# Altium schematic sheet micron_P8.SchDoc
size A; SheetNumber: 8; SheetTotal: 11
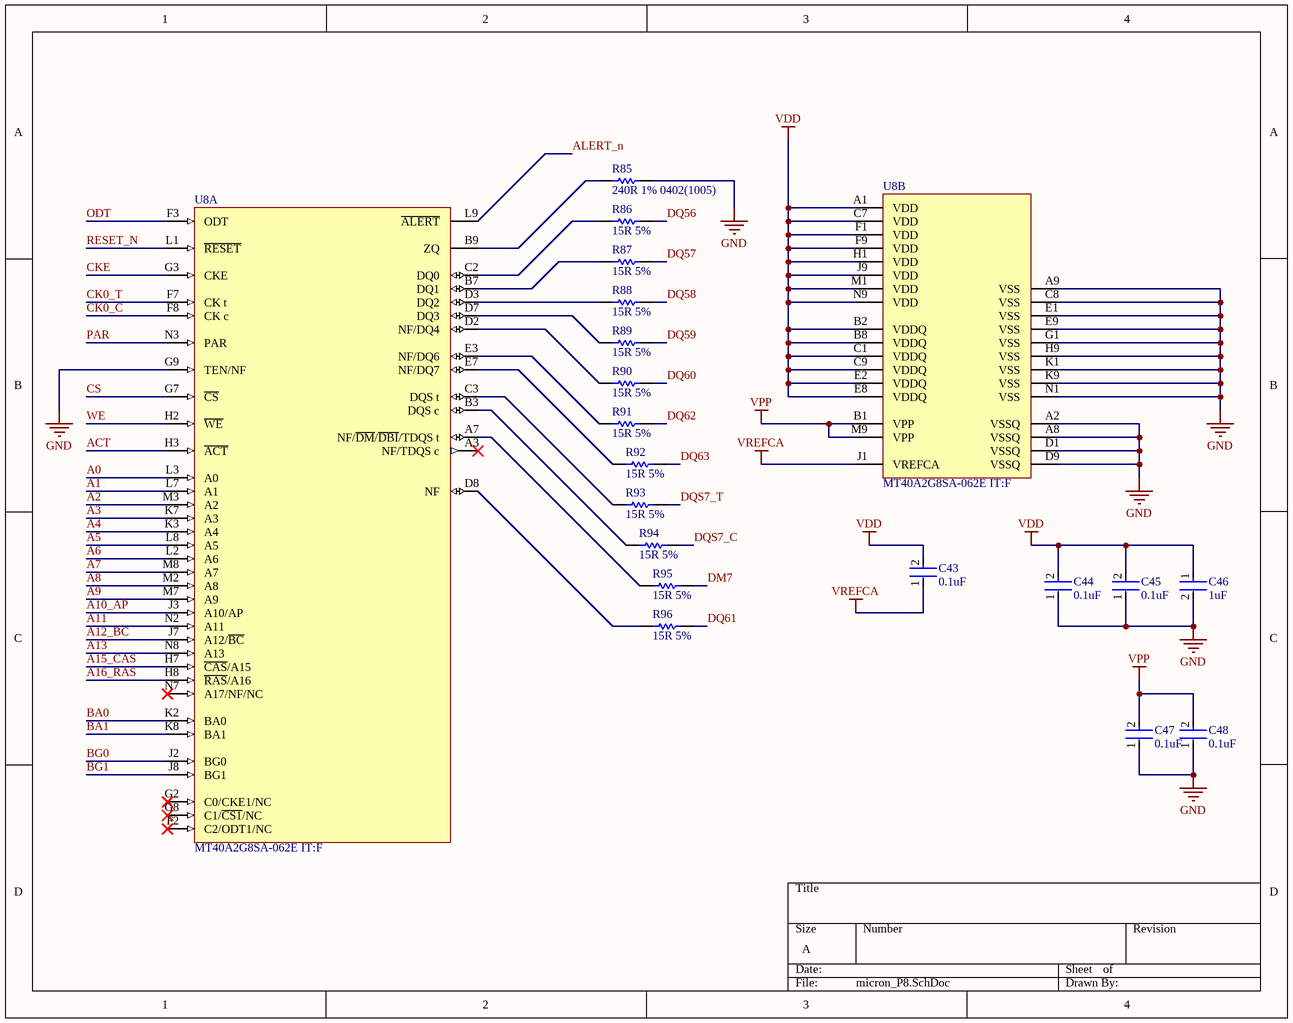
[diagram p0: micron_P8.SchDoc]

## Parts
C43  0.1uF  [FP-GRM15-MFG]
C44  0.1uF  [FP-GRM15-MFG]
C45  0.1uF  [FP-GRM15-MFG]
C46  1uF  [FP-CL511-IPC_C]
C47  0.1uF  [FP-GRM15-MFG]
C48  0.1uF  [FP-GRM15-MFG]
R85  240R 1% 0402(1005)  [RESC0402(1005)_L]
R86  15R 5%  [RESC1005X40X25LL05T10]
R87  15R 5%  [RESC1005X40X25LL05T10]
R88  15R 5%  [RESC1005X40X25LL05T10]
R89  15R 5%  [RESC1005X40X25LL05T10]
R90  15R 5%  [RESC1005X40X25LL05T10]
R91  15R 5%  [RESC1005X40X25LL05T10]
R92  15R 5%  [RESC1005X40X25LL05T10]
R93  15R 5%  [RESC1005X40X25LL05T10]
R94  15R 5%  [RESC1005X40X25LL05T10]
R95  15R 5%  [RESC1005X40X25LL05T10]
R96  15R 5%  [RESC1005X40X25LL05T10]
U8  MT40A2G8SA-062E IT:F  [SA_MFG]  (parts A,B of 2)

## Nets
GND: C44.1 C45.1 C46.2 C47.1 C48.1 R85.2 U8.A2(VSSQ) U8.A8(VSSQ) U8.A9(VSS) U8.C8(VSS) U8.D1(VSSQ) U8.D9(VSSQ) U8.E1(VSS) U8.E9(VSS) U8.G1(VSS) U8.G9(TEN/NF) U8.H9(VSS) U8.K1(VSS) U8.K9(VSS) U8.N1(VSS)
VDD: C43.2 C44.2 C45.2 C46.1 U8.A1(VDD) U8.B2(VDDQ) U8.B8(VDDQ) U8.C1(VDDQ) U8.C7(VDD) U8.C9(VDDQ) U8.E2(VDDQ) U8.E8(VDDQ) U8.F1(VDD) U8.F9(VDD) U8.H1(VDD) U8.J9(VDD) U8.M1(VDD) U8.N9(VDD)
VPP: C47.2 C48.2 U8.B1(VPP) U8.M9(VPP)
VREFCA: C43.1 U8.J1(VREFCA)
A0: U8.L3(A0)
A1: U8.L7(A1)
A2: U8.M3(A2)
A3: U8.K7(A3)
A4: U8.K3(A4)
A5: U8.L8(A5)
A6: U8.L2(A6)
A7: U8.M8(A7)
A8: U8.M2(A8)
A9: U8.M7(A9)
A10_AP: U8.J3(A10/AP)
A11: U8.N2(A11)
A12_BC: U8.J7(A12/~{BC})
A13: U8.N8(A13)
A15_CAS: U8.H7(~{CAS}/A15)
A16_RAS: U8.H8(~{RAS}/A16)
ACT: U8.H3(~{ACT})
ALERT_n: U8.L9(~{ALERT})
BA0: U8.K2(BA0)
BA1: U8.K8(BA1)
BG0: U8.J2(BG0)
BG1: U8.J8(BG1)
CK0_C: U8.F8(CK_c)
CK0_T: U8.F7(CK_t)
CKE: U8.G3(CKE)
CS: U8.G7(~{CS})
DM7: R95.2
DQ56: R86.2
DQ57: R87.2
DQ58: R88.2
DQ59: R89.2
DQ60: R90.2
DQ61: R96.2
DQ62: R91.2
DQ63: R92.2
DQS7_C: R94.2
DQS7_T: R93.2
ODT: U8.F3(ODT)
PAR: U8.N3(PAR)
RESET_N: U8.L1(~{RESET})
WE: U8.H2(~{WE})
NetR85_1: R85.1 U8.B9(ZQ)
NetR86_1: R86.1 U8.C2(DQ0)
NetR87_1: R87.1 U8.B7(DQ1)
NetR88_1: R88.1 U8.D3(DQ2)
NetR89_1: R89.1 U8.D7(DQ3)
NetR90_1: R90.1 U8.D2(NF/DQ4)
NetR91_1: R91.1 U8.E3(NF/DQ6)
NetR92_1: R92.1 U8.E7(NF/DQ7)
NetR93_1: R93.1 U8.C3(DQS_t)
NetR94_1: R94.1 U8.B3(DQS_c)
NetR95_1: R95.1 U8.A7(NF/~{DM}/~{DBI}/TDQS_t)
NetR96_1: R96.1 U8.D8(NF)

Not connected (* = marked no-connect by the designer): U8 A3(NF/TDQS_c)* F2(C2/ODT1/NC)* G2(C0/CKE1/NC)* G8(C1/~{CS1}/NC)* N7(A17/NF/NC)*

## Library data of the parts
C43-C45 C47 C48 = CMP-2100-03641-2: CAP CER 0.1UF 16V X7R 0402; Manufacturer Part Number: GRM155R71C104KA88D; Manufacturer: Murata; Standoff Height: 0mm; Tolerance: 10%; Voltage Rating: 16Vdc; Material: Ceramic; Capacitance: 0.10μF; Value: 0.10μF; RoHS: TRUE; Temperature Characteristic: X7R; Octopart: https://octopart.com/grm155r71c104ka88d-murata-196880; Digikey Description: CAP CER 0.1UF 16V X7R 0402; Device Class L3: Ceramic Capacitors; Height: 0.55mm; ComponentLink2Description: Datasheet; Temperature Range Low: -55°C; Ipc Land Pattern Name: CAPC10050X219; ComponentLink2URL: https://search.murata.co.jp/Ceramy/image/img/A01X/G101/ENG/GRM155R71H471KA01-01A.pdf; Device Class L1: Passive Components; Lead Free: yes; Category: Cap; Package: GRM15; Temperature: -55°C to +125°C; Device Class L2: Capacitors; Temperature Range High: +125°C; Mouser Description: 0402 0.1 uF 16V ±10 % Tolerance X7R SMT Multilayer Ceramic Capacitor
C46 = CMP-13271-001936-1: Cap Ceramic 1uF 10V X5R ±10% SMD 0402 +85°C Paper T/R; Depth: 0.5mm; Case Code (Imperial): 0402; Material: Ceramic; Mount: Surface Mount; Thickness: 0.022inch; Dielectric: X5R; Capacitance: 1uF; Radiation Hardening: No; Case/Package: 0402; Length: 1mm; Tolerance: 10%; Max Operating Temperature: 85°C; Package Quantity: 1; Width: 0.02inch; Voltage Rating: 10V; Contact Plating: Tin; Height: 0.5mm; Min Operating Temperature: -55°C; Case Code (Metric): 1005; Packaging: Tape and Reel
R85 = CMP-1011-00438-1: 240R 0.063W 1% 0402 (1005 Metric)  SMD; Case-Metric: 1005; Case-EIA: 0402; Value: 240.00 Ohm; Power: 0.063 W; Tolerance: 1 %; Technology: SMT
R86-R96 = CMP-2002-07413-1: Manufacturer: Yageo / Phycomp; Part Number: RC0402FR-0715RL
U8 = CMP-00526-125391410-1: DRAMChip DDR4 SDRAM 16Gbit 2Gx8 1.2V 78-Pin FBGA Tray; ComponentLink1URL: http://www.micron.com/; ComponentLink3Description: Manufacturer's Package Drawing; ComponentLink2Description: Datasheet URL; ComponentLink1Description: Manufacturer's Website; ComponentLink3URL: https://www.micron.com/content/dam/micron/global/public/products/customer-service-note/csn33-bga-user-guide.pdf; HelpURL: https://4donline.ihs.com/images/VipMasterIC/IC/MICT/MICT-S-A0014105731/MICT-S-A0014105731-1.pdf?hkey=6D3A4C79FDBF58556ACFDE234799DDF0; ComponentLink2URL: https://4donline.ihs.com/images/VipMasterIC/IC/MICT/MICT-S-A0014105731/MICT-S-A0014105731-1.pdf?hkey=6D3A4C79FDBF58556ACFDE234799DDF0